# Altium schematic sheet extBoard_sheet1_cover.SchDoc: EXT BOARD - Cover
size A4; Revision: 0.1.0; SheetNumber: 1; SheetTotal: 5; Author: NALO; DrawnBy: NALO; DocumentSize: A4; PCAName: EXT BOARD; ProjectName: Bachelor's Thesis
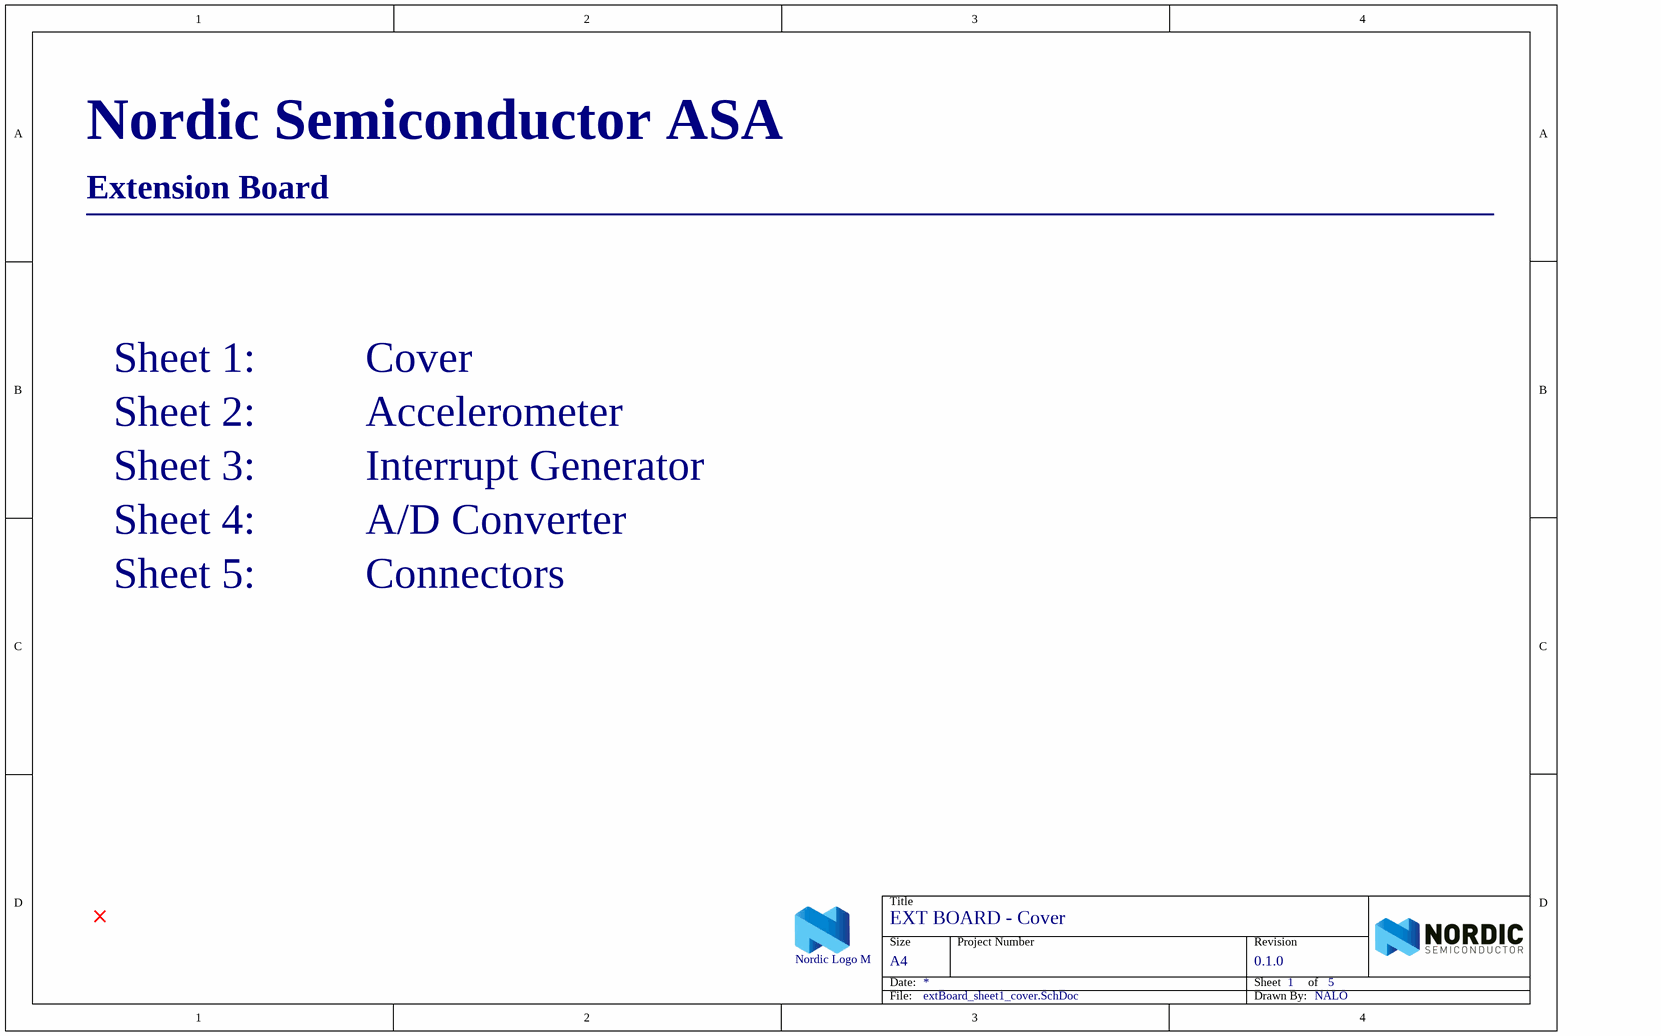
[diagram p0: extBoard_sheet1_cover.SchDoc]

## Parts
LOGO1  Nordic Logo M  [NORDIC_LOGO_M]  (no BOM)

## Notes on the sheet
- Nordic Semiconductor ASA
- Extension Board
- ________________________________________________________________
- Sheet 1:          Cover
- Sheet 2:          Accelerometer
- Sheet 3:          Interrupt Generator
- Sheet 4:          A/D Converter
- Sheet 5:          Connectors
- Title
- Size
- Date:
- Project Number
- Sheet         of
- Revision
- File:
- Drawn By:

## Library data of the parts
LOGO1 = Nordic Logo M: Nordic Logo, medium size; Artikkelnr Noca: N.A.; Part Number: Nordic Logo M; Manufacturer: *; Manufacturer Part Number: *; Datasheet: *; LatestRevisionDate: 2016-09-07; Publisher: Nordic Semiconductor; Value: Nordic Logo M; Note: *; Supplier: *; Supplier part number: *; 2nd source Supplier: *; 2nd source part number: *; Pin Count: 0; Published: 2010-02-18; Footprint Doc: Segger Logo M; Artikkelnr Simpro: N.A.